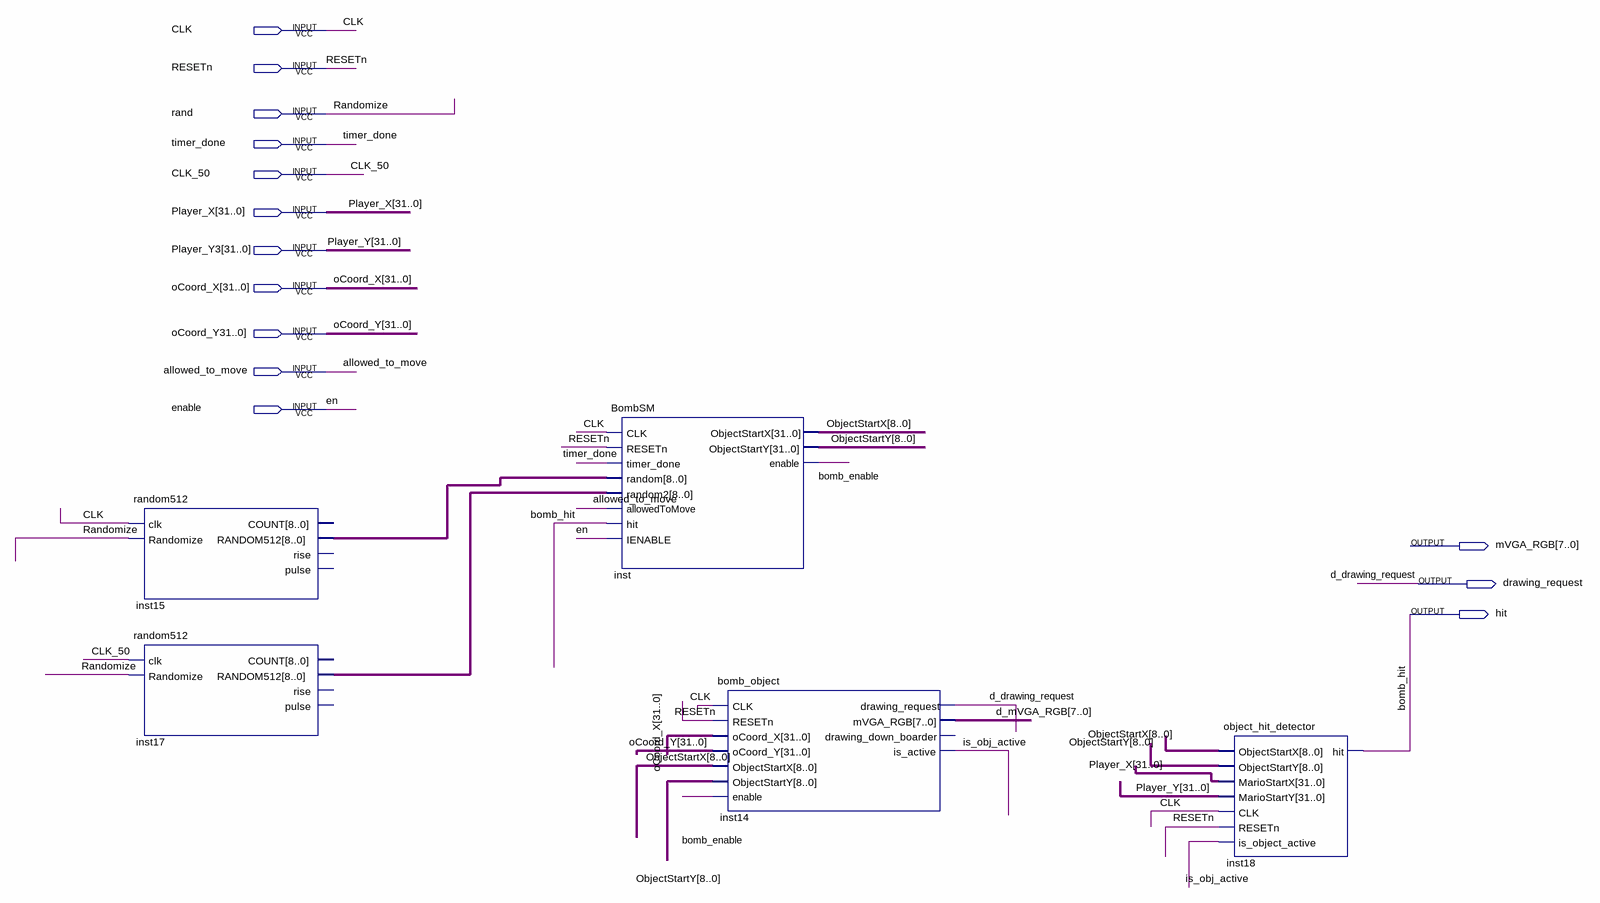
[diagram p0: schematic sheet]
// Quartus schematic BombFull.bdf as structural Verilog: 5 symbols, 14 pins
module BombFull (
  input  CLK,
  input  RESETn,
  input  \rand ,
  input  timer_done,
  input  CLK_50,
  input  [31:0] Player_X,
  input  [31:0] Player_Y3,
  input  [31:0] oCoord_X,
  input  \oCoord_Y31..0] ,
  input  allowed_to_move,
  input  enable,
  output [7:0] mVGA_RGB,
  output drawing_request,
  output hit
);

  wire bomb_enable, is_obj_active;
  wire [7:0] d_mVGA_RGB;
  wire [8:0] inst15_random512, inst17_random512, ObjectStartX, ObjectStartY;
  wire [31:0] oCoord_Y;

  random512 inst15 (.clk(CLK), .Randomize(\rand ), .RANDOM512(inst15_random512));  // open: COUNT, rise, pulse
  random512 inst17 (.clk(CLK_50), .Randomize(\rand ), .RANDOM512(inst17_random512));  // open: COUNT, rise, pulse
  BombSM inst (
    .CLK(CLK), .RESETn(RESETn), .timer_done(timer_done), .random(inst15_random512),
    .random2(inst17_random512), .allowedToMove(allowed_to_move), .hit(hit), .IENABLE(enable),
    .ObjectStartX(ObjectStartX), .ObjectStartY(ObjectStartY), .enable(bomb_enable));
  bomb_object inst14 (
    .CLK(CLK), .RESETn(RESETn), .oCoord_X(oCoord_X), .oCoord_Y(oCoord_Y), .ObjectStartX(ObjectStartX),
    .ObjectStartY(ObjectStartY), .enable(bomb_enable), .drawing_request(drawing_request),
    .mVGA_RGB(d_mVGA_RGB), .is_active(is_obj_active));  // open: drawing_down_boarder
  object_hit_detector inst18 (
    .ObjectStartX(ObjectStartX), .ObjectStartY(ObjectStartY), .MarioStartX(Player_X),
    .MarioStartY(Player_Y3), .CLK(CLK), .RESETn(RESETn), .is_object_active(is_obj_active), .hit(hit));

  // Other names for the same wires on the sheet: bomb_hit = hit; d_drawing_request = drawing_request; en = enable;
  //   Player_Y[31:0] = Player_Y3; Randomize = \rand 
endmodule
